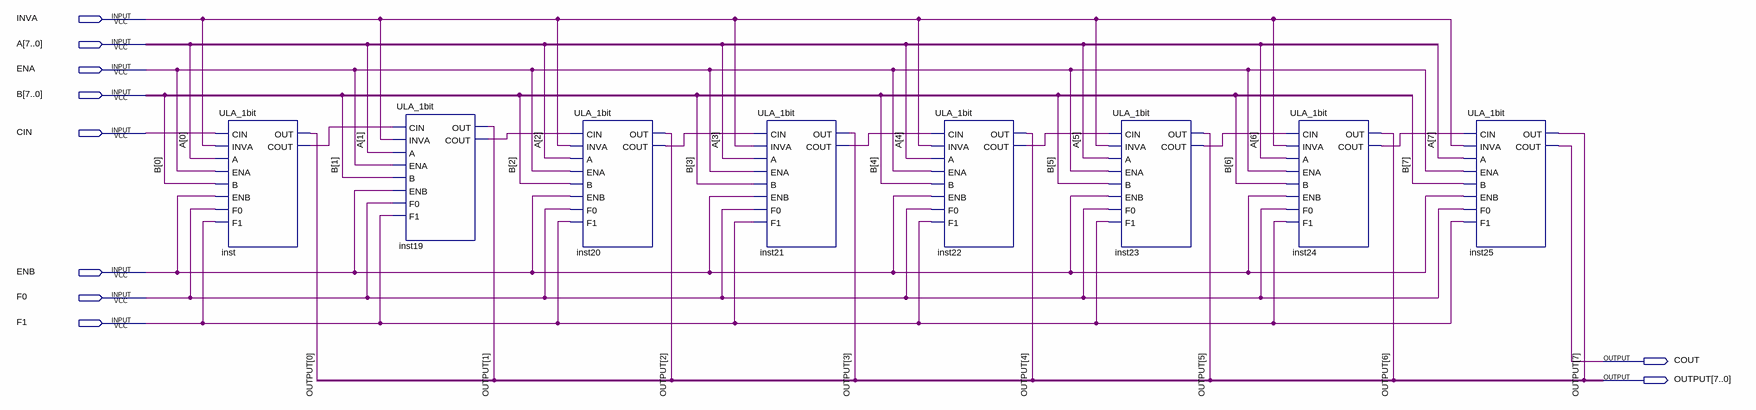
[diagram p0: schematic sheet]
// Quartus schematic ULA_8bits.bdf as structural Verilog: 8 symbols, 10 pins
module ULA_8bits (
  input  INVA,
  input  [7:0] A,
  input  ENA,
  input  [7:0] B,
  input  CIN,
  input  ENB,
  input  F0,
  input  F1,
  output COUT,
  output [7:0] OUTPUT
);

  wire inst19_cout, inst20_cout, inst21_cout, inst22_cout, inst23_cout, inst24_cout, inst_cout;

  ULA_1bit inst (
    .CIN(CIN), .INVA(INVA), .A(A[0]), .ENA(ENA), .B(B[0]), .ENB(ENB), .F0(F0), .F1(F1), .OUT(OUTPUT[0]),
    .COUT(inst_cout));
  ULA_1bit inst19 (
    .CIN(inst_cout), .INVA(INVA), .A(A[1]), .ENA(ENA), .B(B[1]), .ENB(ENB), .F0(F0), .F1(F1),
    .OUT(OUTPUT[1]), .COUT(inst19_cout));
  ULA_1bit inst20 (
    .CIN(inst19_cout), .INVA(INVA), .A(A[2]), .ENA(ENA), .B(B[2]), .ENB(ENB), .F0(F0), .F1(F1),
    .OUT(OUTPUT[2]), .COUT(inst20_cout));
  ULA_1bit inst21 (
    .CIN(inst20_cout), .INVA(INVA), .A(A[3]), .ENA(ENA), .B(B[3]), .ENB(ENB), .F0(F0), .F1(F1),
    .OUT(OUTPUT[3]), .COUT(inst21_cout));
  ULA_1bit inst22 (
    .CIN(inst21_cout), .INVA(INVA), .A(A[4]), .ENA(ENA), .B(B[4]), .ENB(ENB), .F0(F0), .F1(F1),
    .OUT(OUTPUT[4]), .COUT(inst22_cout));
  ULA_1bit inst23 (
    .CIN(inst22_cout), .INVA(INVA), .A(A[5]), .ENA(ENA), .B(B[5]), .ENB(ENB), .F0(F0), .F1(F1),
    .OUT(OUTPUT[5]), .COUT(inst23_cout));
  ULA_1bit inst24 (
    .CIN(inst23_cout), .INVA(INVA), .A(A[6]), .ENA(ENA), .B(B[6]), .ENB(ENB), .F0(F0), .F1(F1),
    .OUT(OUTPUT[6]), .COUT(inst24_cout));
  ULA_1bit inst25 (
    .CIN(inst24_cout), .INVA(INVA), .A(A[7]), .ENA(ENA), .B(B[7]), .ENB(ENB), .F0(F0), .F1(F1),
    .OUT(OUTPUT[7]), .COUT(COUT));
endmodule
